# EAGLE design Prototype 4 (EAGLE 6.0)
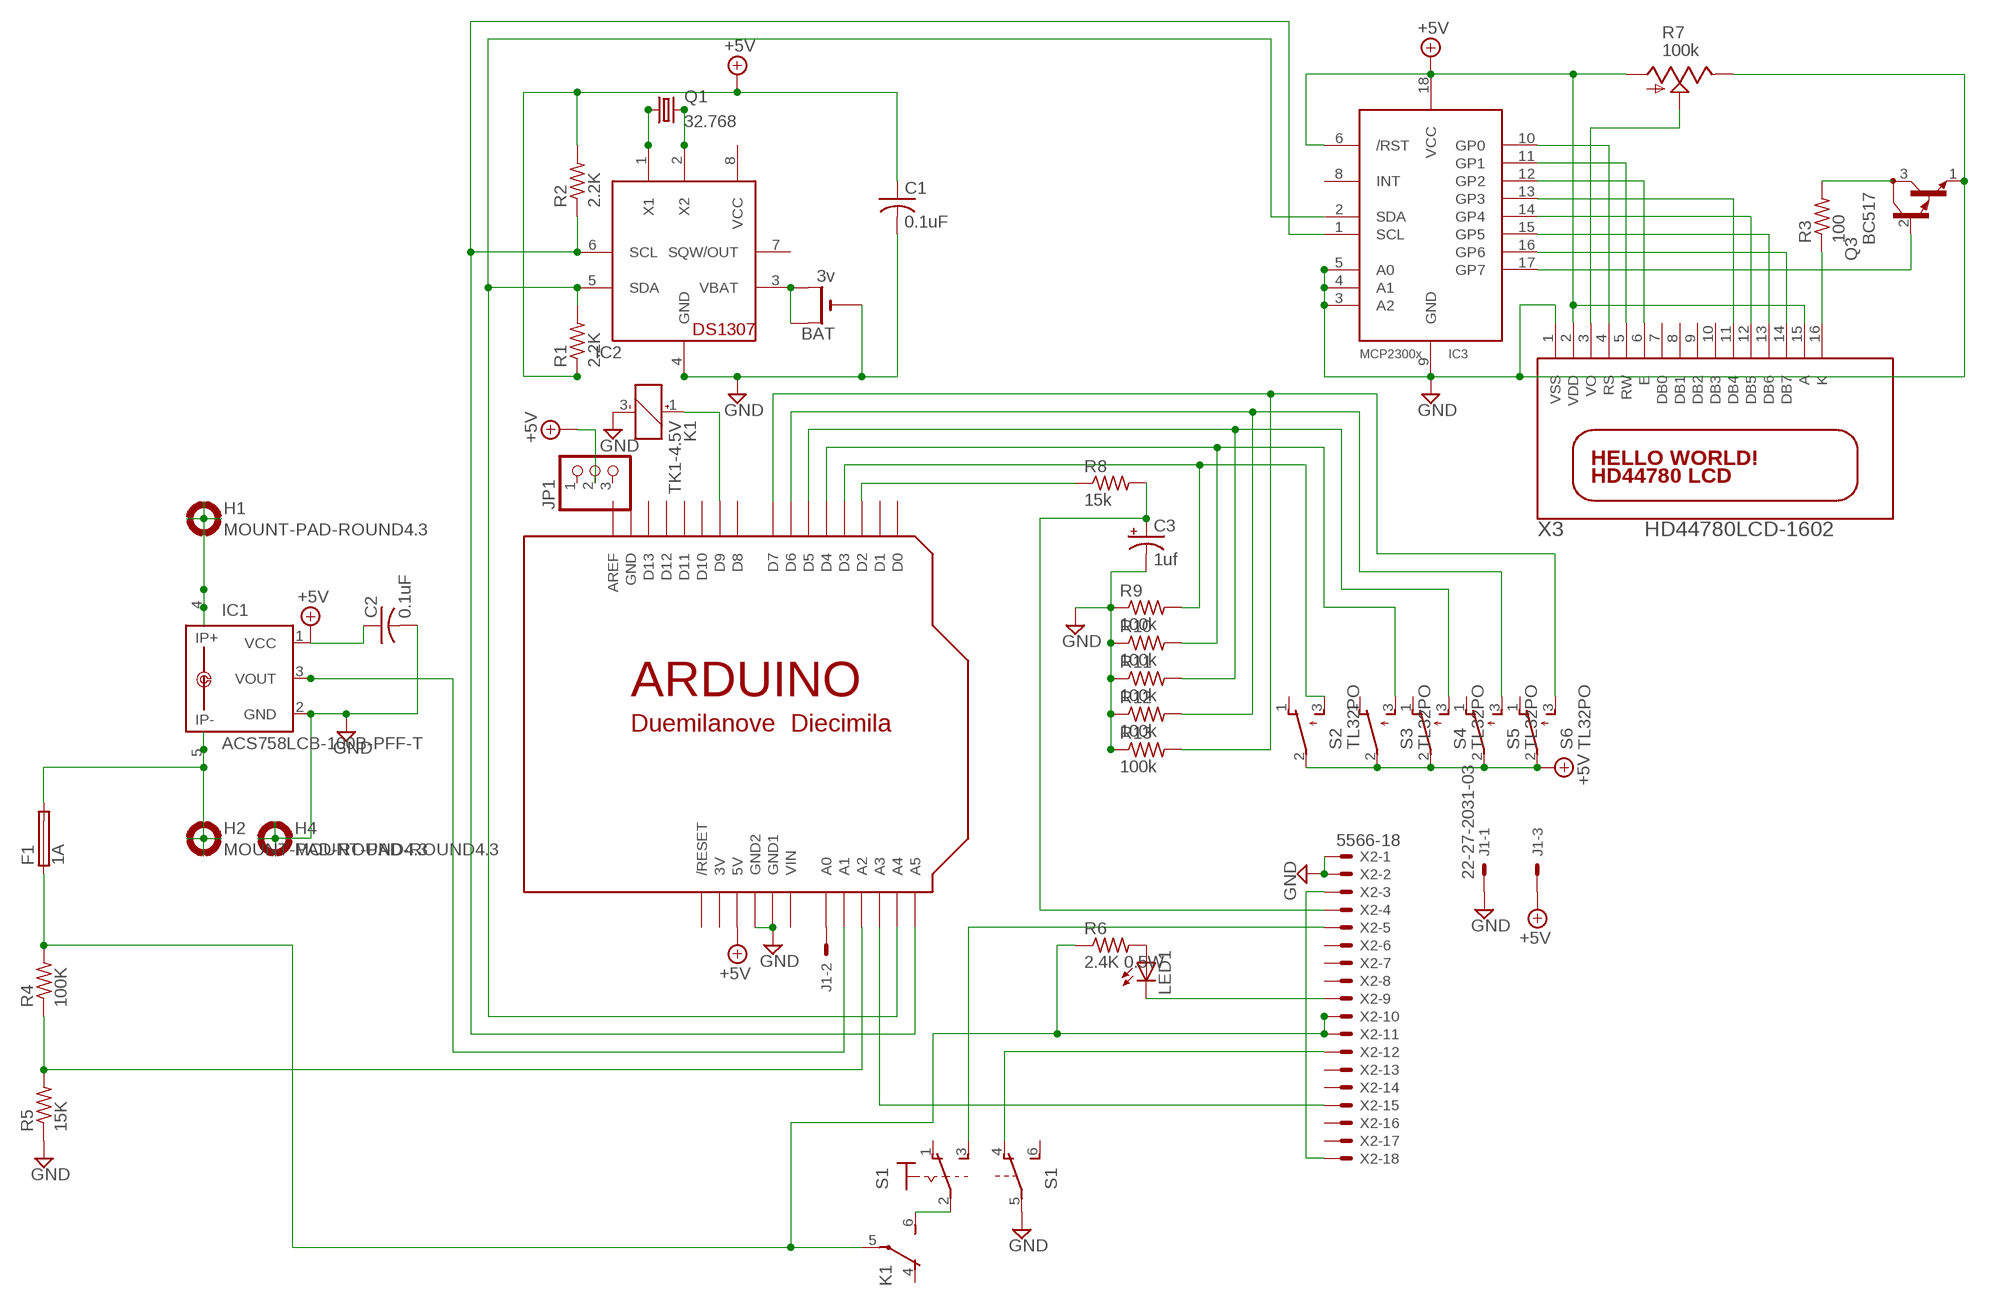
[diagram p0: schematic, sheet 1]

## Parts
BAT  3v  CR1220THM  [CR1220-THM]
C1  0.1uF  C-US050-024X044  [C050-024X044]
C2  0.1uF  C-US050-024X044  [C050-024X044]
C3  1uf  CPOL-USE2,5-6E  [E2,5-6E]
F1  1A  SH22,5  [SH22,5]
H1  MOUNT-PAD-ROUND4.3  [4,3-PAD]
H2  MOUNT-PAD-ROUND4.3  [4,3-PAD]
H4  MOUNT-PAD-ROUND4.3  [4,3-PAD]
IC1  ACS758LCB-100B-PFF-T  [CB-PFF]
IC2  DS1307  [DIL08]
IC3  MCP2300X/P  [DIL18]
J1  22-27-2031-03  [6410-03]
JP1  PINHD-1X3  [1X03]
K1  TK1-4.5V  [TK]
LED1  LED5MM  [LED5MM]
Q1  32.768  CRYSTALTC38H  [TC38H]
Q3  BC517  [TO92]
R1  2.2K  R-US_0207/10  [0207/10]
R2  2.2K  R-US_0207/10  [0207/10]
R3  100  R-US_0207/10  [0207/10]
R4  100K  R-US_0207/10  [0207/10]
R5  15K  R-US_0207/10  [0207/10]
R6  2.4K 0.5W  R-US_0207/10  [0207/10]
R7  100k  TRIM_US-B25U  [B25U]
R8  15k  R-US_0207/10  [0207/10]
R9  100k  R-US_0207/10  [0207/10]
R10  100k  R-US_0207/10  [0207/10]
R11  100k  R-US_0207/10  [0207/10]
R12  100k  R-US_0207/10  [0207/10]
R13  100k  R-US_0207/10  [0207/10]
S1  320-938  [320-938]
S2  TL32PO  [TL3XPO]
S3  TL32PO  [TL3XPO]
S4  TL32PO  [TL3XPO]
S5  TL32PO  [TL3XPO]
S6  TL32PO  [TL3XPO]
U$1  ARDUINO-NOHOLE  [ARDUINO-NOHOLE]
X2  5566-18  [5566-18]
X3  HD44780LCD-1602  [LCD1602]

## Nets
24V [Power]: F1.2 H2.B4,3(MOUNT) IC1.5(IP-) IC1.IP-1
+5V [Power]: C1.1 C2.1 IC1.1(VCC) IC3.6(/RST) IC3.18(VCC) J1.3 JP1.2 R1.1 R2.2 R7.A S2.2(P) S3.2(P) S4.2(P) S5.2(P) S6.2(P) U$1.5V X3.2(VDD) X3.15(A)
GND [Power]: BAT.- C1.2 C2.2 C3.- H4.B4,3(MOUNT) IC1.2(GND) IC2.4(GND) IC3.3(A2) IC3.4(A1) IC3.5(A0) IC3.9(GND) J1.1 K1.3(-:-) Q3.1(E) R5.1 R7.E R9.1 R10.1 R11.1 R12.1 R13.1 S1.5(B:P) U$1.GND1 U$1.GND2 X2.1 X2.2 X3.1(VSS)
N$1: IC2.1(X1) Q1.1
N$2: IC2.2(X2) Q1.2
N$3: C3.+ R8.2 X2.4
N$4: BAT.+1(+) BAT.+2(+1) IC2.3(VBAT)
N$5: J1.2 U$1.A0
N$6: IC1.3(VOUT) U$1.A1
N$7: IC2.6(SCL) IC3.1(SCL) R2.1 U$1.A5
N$9: IC2.5(SDA) IC3.2(SDA) R1.2 U$1.A4
N$10 [Power]: H1.B4,3(MOUNT) IC1.4(IP+) IC1.IP+1
N$11: IC3.12(GP2) X3.6(E)
N$12: IC3.11(GP1) X3.5(RW)
N$13: IC3.10(GP0) X3.4(RS)
N$14: R9.2 S2.3(S) U$1.D3
N$15: R10.2 S3.3(S) U$1.D4
N$16 [Power]: S1.3(1:S) X2.5
N$17 [Power]: K1.6(1:S) S1.2(1:P)
N$18: LED1.K(C) X2.9
N$19: R4.1 R5.2 U$1.A2
N$22 [Power]: S1.4(B:O) X2.12
N$23: K1.1(-:+) U$1.D9
N$26: R8.1 U$1.D2
N$27: R13.2 S6.3(S) U$1.D7
N$28: IC3.17(GP7) Q3.2(B)
N$29: IC3.13(GP3) X3.11(DB4)
N$30: R3.1 X3.16(K)
N$32: Q3.3(C) R3.2
N$36: LED1.A R6.2
N$37: IC3.14(GP4) X3.12(DB5)
N$38: U$1.A3 X2.15
N$39: R11.2 S4.3(S) U$1.D5
N$41: X2.3 X2.18
N$43: IC3.15(GP5) X3.13(DB6)
N$44 [Power]: F1.1 K1.5(1:P) R4.2 R6.1 X2.10 X2.11
N$45: IC3.16(GP6) X3.14(DB7)
N$47: R7.S X3.3(VO)
N$48: R12.2 S5.3(S) U$1.D6
Unconnected: IC2.7(SQW/OUT) IC3.8(INT) JP1.1 JP1.3 K1.4(1:O) S1.1(1:O) S1.6(B:S) S2.1(O) S3.1(O) S4.1(O) S5.1(O) S6.1(O) U$1.AREF U$1.D0 U$1.D1 U$1.D8 U$1.D10 U$1.D11 U$1.D12 U$1.D13 U$1.RESET(/RESET) X2.6 X2.7 X2.8 X2.13 X2.14 X2.16 X2.17 X3.7(DB0) X3.8(DB1) X3.9(DB2) X3.10(DB3)

## Power pins joined to a net without a drawn wire
3V: U$1.3V
GND: U$1.GND
VCC: IC2.8(VCC)
VIN: U$1.VIN

## Library data of the parts
BAT = adafruit:CR1220: CR1216/CR1220/CR1225 12mm 3V lithium coin cell Great for battery packup. Both SMT and THM holders. Note the THM package has the ground pads on both sides of the PCB so that the masks are the same - this reduces the cost
C1 C2 = adafruit:C-US: CAPACITOR, American symbol
C3 = resistor:CPOL-US: POLARIZED CAPACITOR, American symbol
F1 = fuse:SH22,5: FUSE HOLDER grid 22,5 mm, OGN0031 8201, Schurter (Buerklin); MF: SCHURTER; MPN: 0031.8201; OC_FARNELL: 1162740; OC_NEWARK: 96F8317
H1 H2 H4 = holes:MOUNT-PAD-ROUND: MOUNTING PAD, round
IC1 = allegro:ACS758*: Thermally Enhanced, Fully Integrated, Hall Effect-Based Linear Current Sensor with 100 micro Ohm Current Conductor display layer 49 Reference in BRD and place VIAs on circles Source: http://www.allegromicro.com/en/Products/Part_Numbers/0758/0758.pdf; MPN: ACS758LCB-100B-PFF-T; OC_FARNELL: 1718998; OC_NEWARK: 04R7132
IC2 = adafruit:DS1307: DS1307 Real time clock (RTC) with battery backup ability. Talk to it via i2c
IC3 = adafruit:MCP2300X: MCP23008 Inexpensive i2c i/o expander - 8 general purpose i/o pins with optional pullups
J1 = con-molex:22-?-03: CONNECTOR wire to board 2.54 mm (.1 inch) pitch header; OC_FARNELL: unknown; OC_NEWARK: unknown
JP1 = adafruit:PINHD-1X3: PIN HEADER
K1 = relay:TK1-?*: ULTRA LOW PROFILE 2 AMP. POLARIZED RELAY NAiS Source: http://www.mew-europe.com/.. en_ds_61018_0000.pdf; MPN: TK1-4.5V; OC_FARNELL: unknown; OC_NEWARK: 13P9054
LED1 = adafruit:LED: LED OSRAM: - CHIPLED LG R971, LG N971, LY N971, LG Q971, LY Q971, LO R971, LY R971 LH N974, LH R974 LS Q976, LO Q976, LY Q976 LO Q996 - Hyper CHIPLED LW Q18S LB Q993, LB Q99A, LB R99A - SideLED LS A670, LO A670, LY A670, LG A670, LP A670 LB A673, LV A673, LT A673, LW A673 LH A674 LY A675 LS A676, LA A676, LO A676, LY A676, LW A676 LS A679, LY A679, LG A679 - Hyper Micro SIDELED® LS Y876, LA Y876, LO Y876, LY Y876 LT Y87S - SmartLED LW L88C, LW L88S LB L89C, LB L89S, LG L890 LS L89K, LO L89K, LY L89K LS L896, LA L896, LO L896, LY L896 - TOPLED LS T670, LO T670, LY T670, LG T670, LP T670 LSG T670, LSP T670, LSY T670, LOP T670, LYG T670 LG T671, LOG T671, LSG T671 LB T673, LV T673, LT T673, LW T673 LH T674 LS T676, LA T676, LO T676, LY T676, LB T676, LH T676, LSB T676, LW T676 LB T67C, LV T67C, LT T67C, LS T67K, LO T67K, LY T67K, LW E67C LS E67B, LA E67B, LO E67B, LY E67B, LB E67C, LV E67C, LT E67C LW T67C LS T679, LY T679, LG T679 LS T770, LO T770, LY T770, LG T770, LP T770 LB T773, LV T773, LT T773, LW T773 LH T774 LS E675, LA E675, LY E675, LS T675 LS T776, LA T776, LO T776, LY T776, LB T776 LHGB T686 LT T68C, LB T68C - Hyper Mini TOPLED® LB M676 - Mini TOPLED Santana® LG M470 LS M47K, LO M47K, LY M47K Source: http://www.osram.convergy.de/
Q1 = crystal:CRYSTAL: CRYSTAL; OC_FARNELL: unknown; OC_NEWARK: unknown
Q3 = transistor-npn:BC517*: NPN Darlington Transistor
R1-R6 R8-R13 = adafruit:R-US_: RESISTOR, American symbol
R7 = pot:TRIM_US-: POTENTIOMETER
S1 = switch:320-938: TOGGLE SWITCH distributor RS Components
S2-S6 = switch:TL32PO: TINY SWITCH ON - MOM Source: http://www2.produktinfo.conrad.com/datenblaetter/700000-724999/705152-da-01-de-Subminiaturschalter_TL_36YO.pdf
U$1 = adafruit:ARDUINO: Arduino Diecimila/Duemilanove Make a shield with ease, this package has all the named pins as well as the two mounting drill holes and an outline of the USB and DC power connector. The outline is on the DIMENSION layer, so if your board house uses it they will cut the outline to match. http://www.ladyada.net/library/pcb/eaglelibrary.html
X2 = con-molex:5566-18: Mini FIT connector 18 pol Source: http://www.molex.com; OC_FARNELL: unknown; OC_NEWARK: unknown
X3 = adafruitedit:HD44780LCD: HD44780 LCD Standard character type LCDs, available in sizes from 8x1 to 40x4!

## Net classes
0 default: width 0.381 mm, clearance 0.457 mm
1 High Current: width 5 mm, clearance 0.457 mm
2 Power: width 0.635 mm, clearance 0.457 mm

## Board
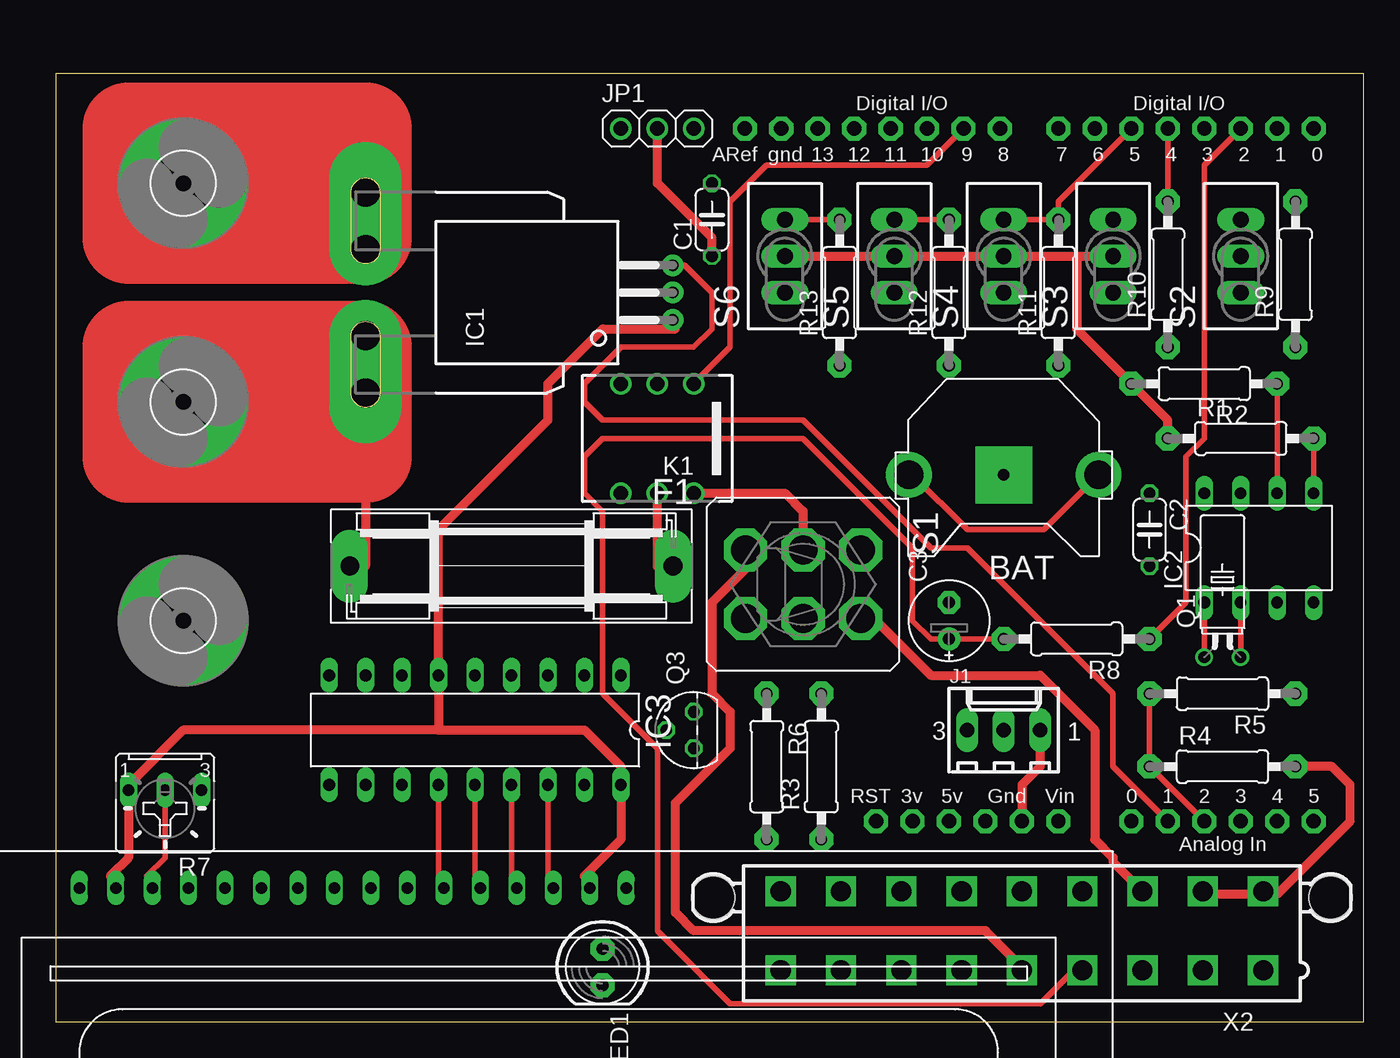
[diagram p1: board, top side]
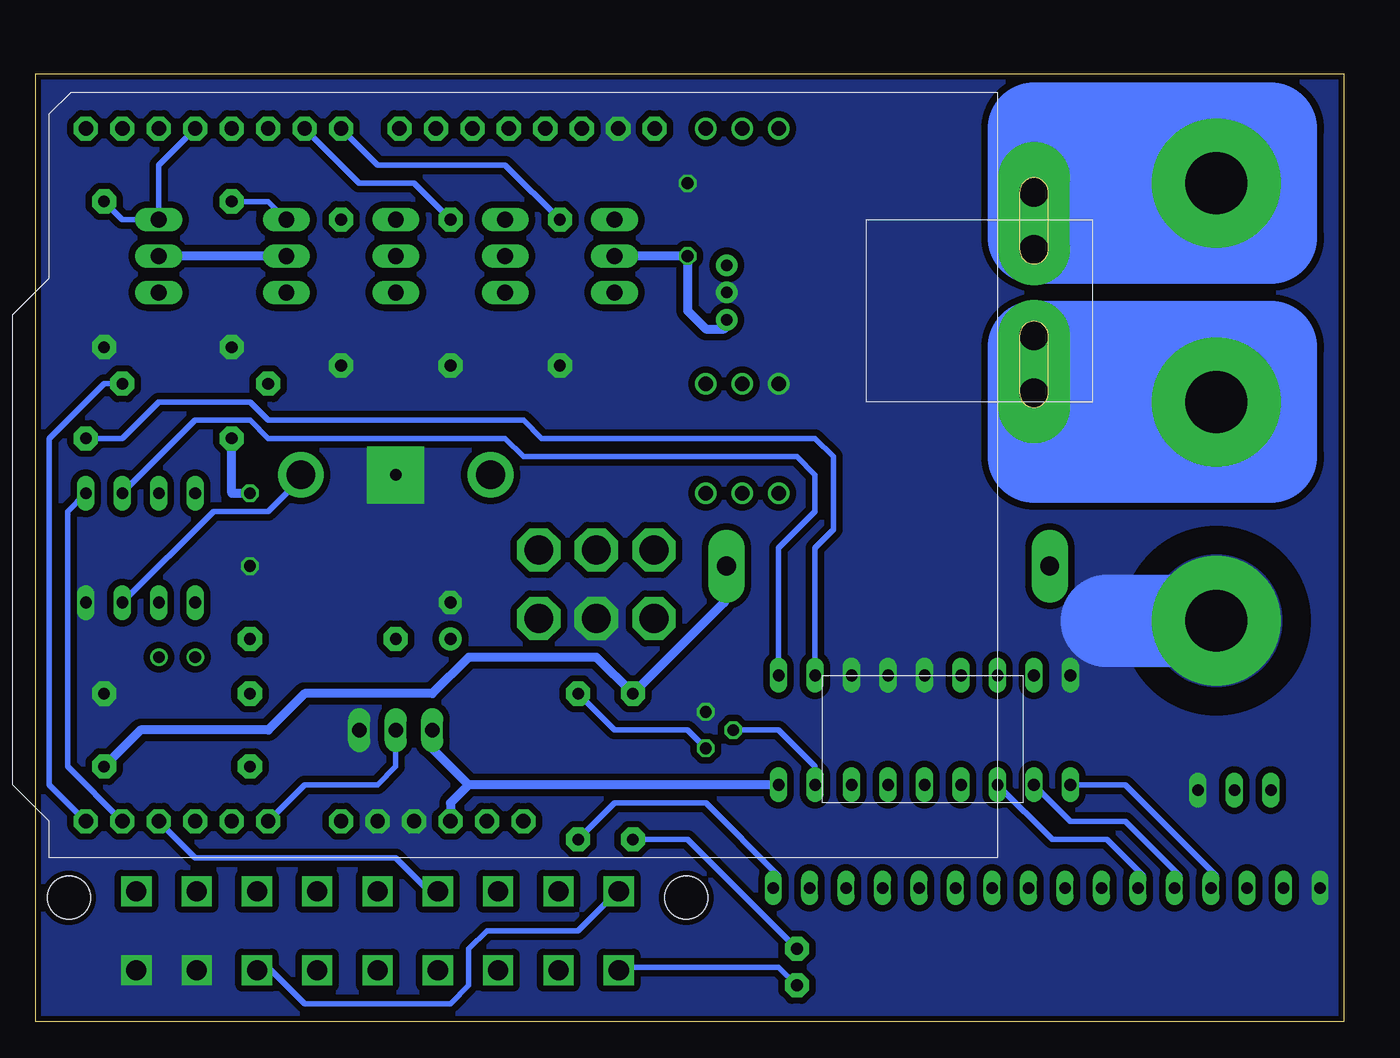
[diagram p2: board, bottom side, seen from below]

Size 91.11 x 66.03 mm. Coordinates in mm from the lower left corner, seen from the top.
Outline: 0,0 91.11,0 91.11,66.03 0,66.03 0,0
Copper layers (1*16): Top 0.0356mm / dielectric 1.5011mm / Bottom 0.0356mm
Design rules: minimum track width 6mil, minimum drill 13mil, track to track 6mil, track to pad 6mil, pad to pad 6mil, via to via 6mil, smd to smd 6mil, copper to edge 15mil, drill to drill 6mil, minimum pad ring 7mil, minimum via ring 7mil, stop-mask expansion 4mil, vias tented up to drill 0mil, thermal gap 10mil

### Footprints (pad centres in the part's own frame; a part is rotated, then mirrored left to right if it is on the bottom)
CR1220-THM = drill 2 pad 3.175: +1 -6.604,0; +2 6.604,0 | drill 0.8 pad 3.962 square: - 0,0
C050-024X044 = drill 0.813 octagon: 1 -2.54,0; 2 2.54,0
E2,5-6E = drill 0.813 pad 1.575: + -1.27,0 | drill 0.813 pad 1.575 octagon: - 1.27,0
SH22,5 = drill 1.321 pad 2.54 long: 1 -11.252,0; 2 11.252,0
4,3-PAD = drill 4.3 pad 9: B4,3 0,0
CB-PFF = drill 0.8 pad 1.5: 1 -1.91,-21.4; 2 0,-21.4; 3 1.91,-21.4 | drill 2 pad 5 offset: 4 3,0; 5 -3,0 | drill 2 pad 4 offset: IP+1 7,0; IP-1 -7,0
DIL08 = drill 0.813 long: 1 -3.81,-3.81; 2 -1.27,-3.81; 3 1.27,-3.81; 4 3.81,-3.81; 5 3.81,3.81; 6 1.27,3.81; 7 -1.27,3.81; 8 -3.81,3.81
DIL18 = drill 0.813 long: 1 -10.16,-3.81; 2 -7.62,-3.81; 3 -5.08,-3.81; 4 -2.54,-3.81; 5 0,-3.81; 6 2.54,-3.81; 7 5.08,-3.81; 8 7.62,-3.81; 9 10.16,-3.81; 10 10.16,3.81; 11 7.62,3.81; 12 5.08,3.81; 13 2.54,3.81; 14 0,3.81; 15 -2.54,3.81; 16 -5.08,3.81; 17 -7.62,3.81; 18 -10.16,3.81
6410-03 = drill 1.016 long: 1 2.54,0; 2 0,0; 3 -2.54,0
1X03 = drill 1.016: 1 -2.54,0; 2 0,0; 3 2.54,0
TK = drill 1: 1 -2.54,-3.81; 2 0,-3.81; 3 2.54,-3.81; 4 2.54,3.81; 5 0,3.81; 6 -2.54,3.81
LED5MM = drill 0.813 pad 1.676 octagon: A -1.27,0; K 1.27,0
TC38H = drill 0.813: 1 -1.27,0; 2 1.27,0
TO92 = drill 0.813 octagon: 1 1.27,0; 2 0,1.905; 3 -1.27,0
0207/10 = drill 0.813 pad 1.676 octagon: 1 -5.08,0; 2 5.08,0
B25U = drill 0.813 long: A 2.54,-0.889; E -2.54,-0.889; S 0,-0.889
320-938 = drill 2.007 octagon: 1 -2.388,4.013; 2 -2.388,0; 3 -2.388,-4.013; 4 2.388,4.013; 5 2.388,0; 6 2.388,-4.013
TL3XPO = drill 1.1 pad 1.422 long: 1 -2.54,0; 2 0,0; 3 2.54,0
ARDUINO-NOHOLE = drill 1 pad 1.676 octagon: 3V 35.56,2.54; 5V 38.1,2.54; A0 50.8,2.54; A1 53.34,2.54; A2 55.88,2.54; A3 58.42,2.54; A4 60.96,2.54; A5 63.5,2.54; AREF 23.876,50.8; D0 63.5,50.8; D1 60.96,50.8; D2 58.42,50.8; D3 55.88,50.8; D4 53.34,50.8; D5 50.8,50.8; D6 48.26,50.8; D7 45.72,50.8; D8 41.656,50.8; D9 39.116,50.8; D10 36.576,50.8; D11 34.036,50.8; D12 31.496,50.8; D13 28.956,50.8; GND 26.416,50.8; GND1 43.18,2.54; GND2 40.64,2.54; RESET 33.02,2.54; VIN 45.72,2.54
5566-18 = drill 1.4 square: 1 16.8,-2.75; 2 12.6,-2.75; 3 8.4,-2.75; 4 4.2,-2.75; 5 0,-2.75; 6 -4.2,-2.75; 7 -8.4,-2.75; 8 -12.6,-2.75; 9 -16.8,-2.75; 10 16.8,2.75; 11 12.6,2.75; 12 8.4,2.75; 13 4.2,2.75; 14 0,2.75; 15 -4.2,2.75; 16 -8.4,2.75; 17 -12.6,2.75; 18 -16.8,2.75 | hole 3: 21.5,2.29; -21.5,2.29
LCD1602 = drill 0.8 long: 1 8,33.46; 2 10.54,33.46; 3 13.08,33.46; 4 15.62,33.46; 5 18.16,33.46; 6 20.7,33.46; 7 23.24,33.46; 8 25.78,33.46; 9 28.32,33.46; 10 30.86,33.46; 11 33.4,33.46; 12 35.94,33.46; 13 38.48,33.46; 14 41.02,33.46; 15 43.56,33.46; 16 46.1,33.46

### Placement (x,y rotation side)
BAT  66.04,38.1 180 top
C1  45.72,55.88 90 top
C2  76.2,34.29 270 top
C3  62.23,27.94 90 top
F1  31.75,31.75 180 top
H1  8.89,58.42 0 top
H2  8.89,43.18 0 top
H4  8.89,27.94 0 top
IC1  21.59,50.8 90 top
IC2  83.82,33.02 0 top
IC3  29.21,20.32 180 top
J1  66.04,20.32 0 top
JP1  41.91,62.23 0 top
K1  41.91,40.64 180 top
LED1  38.1,3.81 270 top
Q1  81.28,25.4 0 top
Q3  44.45,20.32 90 top
R1  82.55,40.64 0 top
R2  80.01,44.45 180 top
R3  53.34,17.78 90 top
R4  81.28,17.78 0 top
R5  81.28,22.86 180 top
R6  49.53,17.78 270 top
R7  7.62,15.24 180 top
R8  71.12,26.67 180 top
R9  86.36,52.07 90 top
R10  77.47,52.07 90 top
R11  69.85,50.8 90 top
R12  62.23,50.8 90 top
R13  54.61,50.8 90 top
S1  52.07,30.48 270 top
S2  82.55,53.34 90 top
S3  73.66,53.34 90 top
S4  66.04,53.34 90 top
S5  58.42,53.34 90 top
S6  50.8,53.34 90 top
U$1  24.13,11.43 0 top
X2  67.31,6.35 0 top
X3  -6.35,-24.13 0 top

### Tracks (layer width: path | path; a pad name or v marks a point on that pad's centre or on a via)
24V
  Top 0.635: IC1.5 IC1.IP-1 21.59,43.18 H2.B4,3 | 21.59,39.37 21.59,31.75 F1.2
  Top 6.452: 5.08,43.18 5.08,39.37 21.59,39.37 21.59,43.18 21.59,46.99 5.08,46.99 5.08,43.18 | 5.08,43.18 H2.B4,3 20.32,43.18
+5V
  Top 0.635: X3.15 36.83,10.16 39.37,12.7 IC3.18 39.37,17.78 36.83,20.32 26.67,20.32 | X3.2 3.81,10.16 5.08,11.43 R7.A 5.08,16.51 8.89,20.32 26.67,20.32 | R1.1 77.47,41.91 R2.2 71.12,48.26 71.12,53.34 | 26.67,20.32 IC3.6 26.67,34.29 34.29,41.91 34.29,44.45 38.1,48.26 43.18,48.26 IC1.1 | S6.2 S5.2 S4.2 71.12,53.34 | 71.12,53.34 S3.2 | C1.1 45.72,54.61 41.91,58.42 JP1.2
  Bottom 0.635: IC3.18 60.96,16.51 | 60.96,16.51 62.23,15.24 U$1.5V | R1.1 77.47,36.83 C2.1 | 60.96,16.51 63.5,19.05 J1.3 | S3.2 S2.2 | IC1.1 43.18,48.26 44.45,48.26 45.72,49.53 C1.1 S6.2
GND
  Top 0.635: U$1.GND1 67.31,16.51 68.58,17.78 J1.1
  Bottom 0.635: 43.18,50.8 IC1.2 | Q3.1
  Bottom 6.452: H4.B4,3 16.51,27.94
  pour Bottom (no thermals): 91.44,66.04 0,66.04 0,0 91.44,0
N$1
  Top 0.381: IC2.1 Q1.1
N$2
  Top 0.381: IC2.2 Q1.2
N$3
  Top 0.381: R8.2 C3.+ 60.96,26.67 59.69,27.94 59.69,33.02 52.07,40.64 38.1,40.64 36.83,39.37 36.83,36.83 38.1,35.56 38.1,22.86 41.91,19.05 41.91,6.35 46.99,1.27 68.58,1.27 71.12,3.81 X2.4
N$4
  Top 0.381: BAT.+2 59.69,38.1 63.5,34.29 68.83,34.29 BAT.+1
  Bottom 0.381: IC2.3 78.74,35.56 74.93,35.56 72.39,38.1 BAT.+1
N$5
  Bottom 0.381: J1.2 66.04,17.78 67.31,16.51 72.39,16.51 U$1.A0
N$6
  Top 0.381: IC1.3 43.81,52.71 45.72,50.8 45.72,48.26 44.45,46.99 39.37,46.99 36.83,44.45 36.83,43.18 38.1,41.91 52.07,41.91 60.96,33.02 63.5,33.02 73.66,22.86 73.66,17.78 U$1.A1
N$7
  Top 0.381: R2.1 IC2.6
  Bottom 0.381: U$1.A5 90.17,16.51 90.17,40.64 86.36,44.45 R2.1 | IC3.1 39.37,33.02 36.83,35.56 36.83,38.1 38.1,39.37 57.15,39.37 58.42,40.64 74.93,40.64 76.2,41.91 80.01,41.91 IC2.6
N$9
  Top 0.381: R1.2 IC2.5
  Bottom 0.381: U$1.A4 88.9,17.78 88.9,35.56 IC2.5 | IC3.2 36.83,33.02 35.56,34.29 35.56,39.37 36.83,40.64 55.88,40.64 57.15,41.91 74.93,41.91 76.2,43.18 82.55,43.18 85.09,40.64 R1.2
N$10
  Top 0.635: IC1.IP+1 21.59,57.15 IC1.4 21.59,53.34 16.51,58.42 H1.B4,3
  Top 6.452: 6.35,58.42 H1.B4,3 21.59,58.42 21.59,57.15
N$11
  Bottom 0.381: IC3.12 20.32,12.7 16.51,12.7 13.97,10.16 X3.6
N$12
  Bottom 0.381: IC3.11 19.05,13.97 15.24,13.97 11.43,10.16 X3.5
N$13
  Bottom 0.381: IC3.10 15.24,16.51 8.89,10.16 X3.4
N$14
  Bottom 0.381: U$1.D3 82.55,59.69 S2.3 85.09,55.88 R9.2
N$15
  Top 0.381: R10.2 U$1.D4
  Bottom 0.381: S3.3 74.93,57.15 R10.2
N$16
  Top 0.635: X2.5 67.31,3.81 64.77,6.35 44.45,6.35 43.18,7.62 43.18,15.24 46.99,19.05 46.99,21.59 45.72,22.86 45.72,29.21 48.26,31.75 S1.3
N$17
  Top 0.635: K1.6 50.8,36.83 52.07,35.56 S1.2
N$18
  Bottom 0.381: LED1.K 39.37,3.81 49.53,3.81 X2.9
N$19
  Top 0.381: R5.2 R4.1 U$1.A2
N$22
  Top 0.635: S1.4 57,28.09 60.96,24.13 68.58,24.13 72.39,20.32 72.39,12.7 73.66,11.43 73.66,11.15 X2.12
N$23
  Top 0.381: K1.1 46.99,46.99 46.99,57.15 49.53,59.69 60.71,59.69 U$1.D9 63.5,62.23
N$26
  Top 0.381: R8.1 78.74,29.21 78.74,39.37 80.01,40.64 80.01,59.69 U$1.D2
N$27
  Top 0.381: R13.2 S6.3
  Bottom 0.381: U$1.D7 67.31,59.69 58.42,59.69 R13.2
N$28
  Bottom 0.381: Q3.2 39.37,20.32 36.83,17.78 IC3.17
N$29
  Top 0.381: IC3.13 26.67,10.16 X3.11
N$30
  Bottom 0.381: X3.16 39.37,10.16 44.45,15.24 50.8,15.24 R3.1
N$31
  Bottom 6.452: 21.59,54.61 5.08,54.61 5.08,62.23 21.59,62.23 21.59,54.61
N$32
  Bottom 0.381: Q3.3 45.72,20.32 50.8,20.32 R3.2
N$33
  Bottom 6.452: 6.35,58.42 20.32,58.42
N$34
  Bottom 6.452: 21.59,43.18 21.59,39.37 5.08,39.37 5.08,46.99 21.59,46.99 21.59,43.18 | 21.59,43.18 7.62,43.18
N$35
  Top 6.452: 5.08,54.61 21.59,54.61 21.59,62.23 5.08,62.23 5.08,54.61
N$36
  Bottom 0.381: LED1.A 45.72,12.7 R6.2
N$37
  Top 0.381: IC3.14 29.21,10.16 X3.12
N$38
  Bottom 0.381: U$1.A3 80.01,11.43 66.04,11.43 63.5,8.89 X2.15
N$39
  Top 0.381: S4.3 R11.2 69.85,57.15 U$1.D5
N$41
  Bottom 0.381: X2.18 50.8,8.89 53.34,6.35 59.69,6.35 60.96,5.08 60.96,2.54 62.23,1.27 72.39,1.27 74.93,3.81 X2.3
N$43
  Top 0.381: IC3.15 31.75,10.16 X3.13
N$44
  Top 0.635: X2.11 80.01,8.89 83.82,8.89 X2.10 85.09,8.89 90.17,13.97 90.17,16.51 88.9,17.78 R4.2 | K1.5 41.91,31.75 F1.1
  Bottom 0.635: F1.1 43.18,31.75 43.18,29.21 R6.1 52.07,25.4 60.96,25.4 63.5,22.86 72.39,22.86 74.93,20.32 83.82,20.32 R4.2
N$45
  Top 0.381: IC3.16 34.29,10.16 X3.14
N$47
  Top 0.381: R7.S 7.62,11.43 6.35,10.16 X3.3
N$48
  Top 0.381: R12.2 S5.3
  Bottom 0.381: U$1.D6 68.58,58.42 64.77,58.42 R12.2